# EAGLE schematic crown-C (EAGLE 6.4)
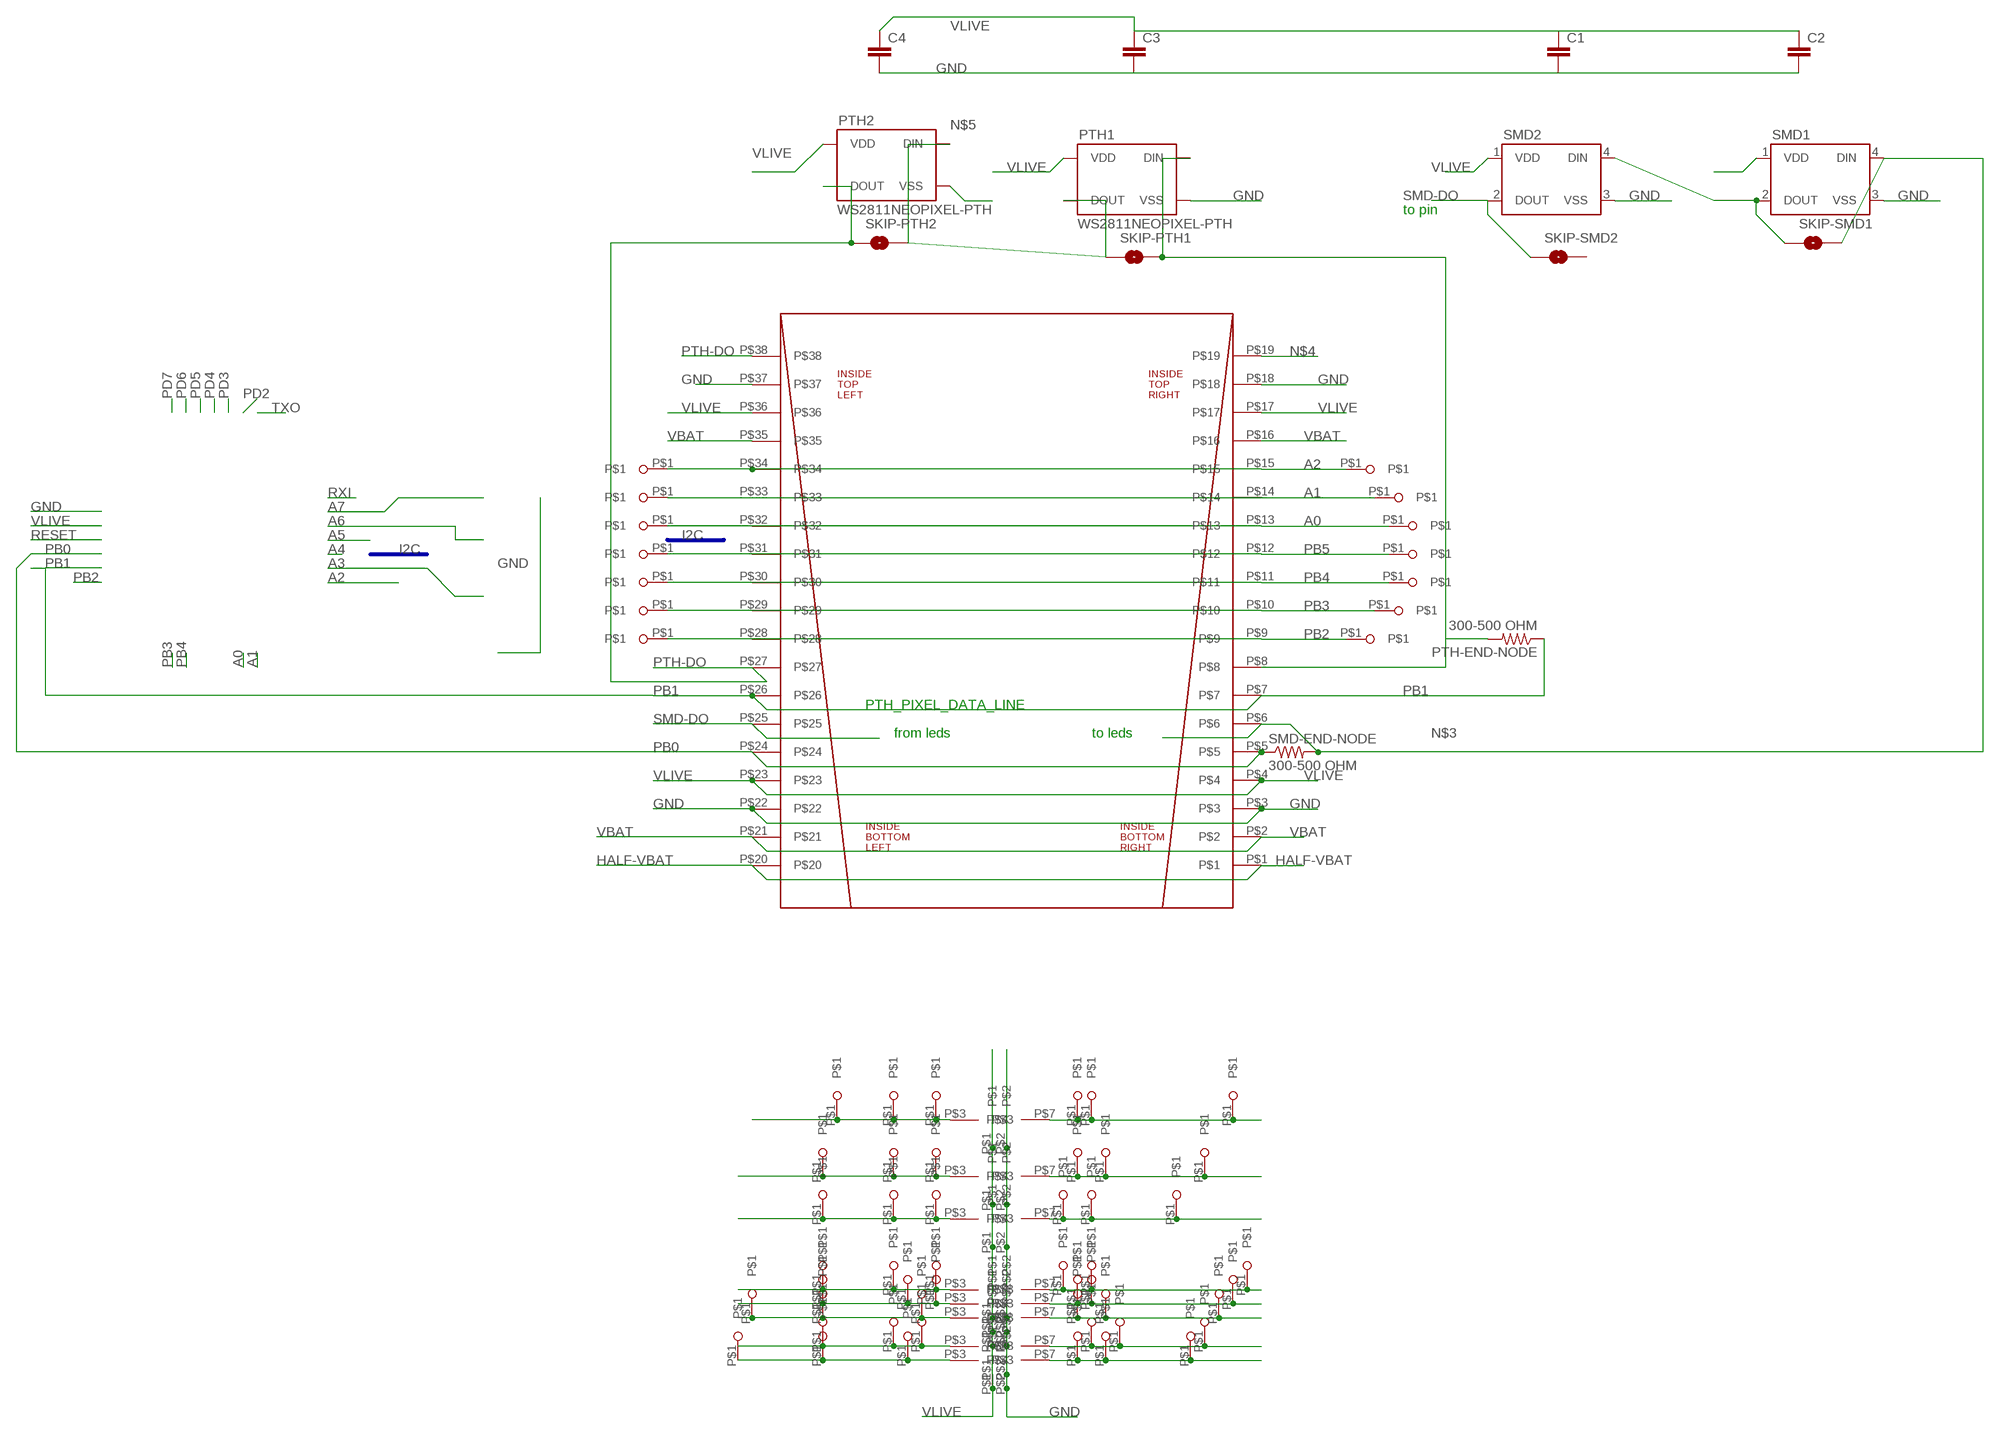
[diagram p0: schematic, sheet 1]

## Parts
C1  CAP0805  [0805]
C2  CAP0805  [0805]
C3  CAP0805  [0805]
C4  CAP0805  [0805]
PTH1  WS2811NEOPIXEL-PTH  [WS2811-PTH-FLAT]
PTH2  WS2811NEOPIXEL-PTH  [WS2811-PTH-FLAT]
PTH-END-NODE  300-500 OHM  RESISTOR0805-RES  [0805]
SKIP-PTH1  SOLDERJUMPERNC2  [SJ_2S-NOTRACE]
SKIP-PTH2  SOLDERJUMPERNC2  [SJ_2S-NOTRACE]
SKIP-SMD1  SOLDERJUMPERNC2  [SJ_2S-NOTRACE]
SKIP-SMD2  SOLDERJUMPERNC2  [SJ_2S-NOTRACE]
SMD1  WS2812B  [WS2812B]
SMD2  WS2812B  [WS2812B]
SMD-END-NODE  300-500 OHM  RESISTOR0805-RES  [0805]
U$1  SMD_BREADBOARD  [SMD_BREADBOARD_4X]
U$2  CROWNSTANDARD  [CROWN]
U$3  SMD_BREADBOARD  [SMD_BREADBOARD_4X]
U$4  SMD_BREADBOARD  [SMD_BREADBOARD_4X]
U$5  SMD_BREADBOARD  [SMD_BREADBOARD_4X]
U$6  SMD_BREADBOARD  [SMD_BREADBOARD_4X]
U$7  SMD_BREADBOARD  [SMD_BREADBOARD_4X]
U$8  SMD_BREADBOARD  [SMD_BREADBOARD_4X]
U$9  SMD_BREADBOARD  [SMD_BREADBOARD_4X]
U$10  SMD_PAD  [SMD_BREADBOARD_PAD]
U$11  SMD_PAD  [SMD_BREADBOARD_PAD]
U$12  SMD_PAD  [SMD_BREADBOARD_PAD]
U$13  SMD_PAD  [SMD_BREADBOARD_PAD]
U$14  SMD_PAD  [SMD_BREADBOARD_PAD]
U$15  SMD_PAD  [SMD_BREADBOARD_PAD]
U$16  SMD_PAD  [SMD_BREADBOARD_PAD]
U$17  SMD_PAD  [SMD_BREADBOARD_PAD]
U$18  SMD_PAD  [SMD_BREADBOARD_PAD]
U$19  SMD_PAD  [SMD_BREADBOARD_PAD]
U$20  SMD_PAD  [SMD_BREADBOARD_PAD]
U$21  SMD_PAD  [SMD_BREADBOARD_PAD]
U$22  SMD_PAD  [SMD_BREADBOARD_PAD]
U$23  SMD_PAD  [SMD_BREADBOARD_PAD]
U$24  SMD_PAD  [SMD_BREADBOARD_PAD]
U$25  SMD_PAD  [SMD_BREADBOARD_PAD]
U$26  SMD_PAD  [SMD_BREADBOARD_PAD]
U$27  SMD_PAD  [SMD_BREADBOARD_PAD]
U$28  SMD_PAD  [SMD_BREADBOARD_PAD]
U$29  SMD_PAD  [SMD_BREADBOARD_PAD]
U$30  SMD_PAD  [SMD_BREADBOARD_PAD]
U$31  SMD_PAD  [SMD_BREADBOARD_PAD]
U$32  SMD_PAD  [SMD_BREADBOARD_PAD]
U$33  SMD_PAD  [SMD_BREADBOARD_PAD]
U$34  SMD_PAD  [SMD_BREADBOARD_PAD]
U$35  SMD_PAD  [SMD_BREADBOARD_PAD]
U$36  SMD_PAD  [SMD_BREADBOARD_PAD]
U$37  SMD_PAD  [SMD_BREADBOARD_PAD]
U$38  SMD_PAD  [SMD_BREADBOARD_PAD]
U$39  SMD_PAD  [SMD_BREADBOARD_PAD]
U$40  SMD_PAD  [SMD_BREADBOARD_PAD]
U$41  SMD_PAD  [SMD_BREADBOARD_PAD]
U$42  SMD_PAD  [SMD_BREADBOARD_PAD]
U$43  SMD_PAD  [SMD_BREADBOARD_PAD]
U$44  SMD_PAD  [SMD_BREADBOARD_PAD]
U$45  SMD_PAD  [SMD_BREADBOARD_PAD]
U$46  SMD_PAD  [SMD_BREADBOARD_PAD]
U$47  SMD_PAD  [SMD_BREADBOARD_PAD]
U$48  SMD_PAD  [SMD_BREADBOARD_PAD]
U$49  SMD_PAD  [SMD_BREADBOARD_PAD]
U$50  SMD_PAD  [SMD_BREADBOARD_PAD]
U$51  SMD_PAD  [SMD_BREADBOARD_PAD]
U$52  SMD_PAD  [SMD_BREADBOARD_PAD]
U$53  SMD_PAD  [SMD_BREADBOARD_PAD]
U$54  SMD_PAD  [SMD_BREADBOARD_PAD]
U$55  SMD_PAD  [SMD_BREADBOARD_PAD]
U$56  SMD_PAD  [SMD_BREADBOARD_PAD]
U$57  SMD_PAD  [SMD_BREADBOARD_PAD]
U$58  SMD_PAD  [SMD_BREADBOARD_PAD]
U$59  SMD_PAD  [SMD_BREADBOARD_PAD]
U$60  SMD_PAD  [SMD_BREADBOARD_PAD]
U$61  SMD_PAD  [SMD_BREADBOARD_PAD]
U$62  SMD_PAD  [SMD_BREADBOARD_PAD]
U$63  SMD_PAD  [SMD_BREADBOARD_PAD]
U$64  SMD_PAD  [SMD_BREADBOARD_PAD]
U$65  SMD_PAD  [SMD_BREADBOARD_PAD]
U$66  SMD_PAD  [SMD_BREADBOARD_PAD]
U$67  SMD_PAD  [SMD_BREADBOARD_PAD]
U$68  SMD_PAD  [SMD_BREADBOARD_PAD]
U$69  SMD_PAD  [SMD_BREADBOARD_PAD]
U$70  SMD_PAD  [SMD_BREADBOARD_PAD]
U$71  SMD_PAD  [SMD_BREADBOARD_PAD]

## Nets
A0: U$2.P$13 U$2.P$32 U$44.P$1 U$55.P$1
A1: U$2.P$14 U$2.P$33 U$43.P$1 U$56.P$1
A2: U$2.P$15 U$2.P$34 U$42.P$1 U$58.P$1
GND: C1.2 C2.2 C3.2 C4.2 PTH1.P$2(VSS) PTH1.P$6(VSS) PTH2.P$2(VSS) PTH2.P$6(VSS) SMD1.3(VSS) SMD2.3(VSS) U$1.P$2 U$2.P$3 U$2.P$18 U$2.P$22 U$2.P$37 U$3.P$2 U$4.P$2 U$5.P$2 U$6.P$2 U$7.P$2 U$8.P$2 U$9.P$2
HALF-VBAT: U$2.P$1 U$2.P$20
N$2: U$1.P$3 U$24.P$1 U$25.P$1 U$63.P$1
N$3: SKIP-SMD1.2 SMD1.4(DIN) SMD-END-NODE.2 U$2.P$6
N$4: PTH1.P$4(DIN) PTH1.P$8(DIN) PTH-END-NODE.2 SKIP-PTH1.2 U$2.P$8 U$2.P$19
N$5: PTH1.P$1(DOUT) PTH1.P$5(DOUT) PTH2.P$4(DIN) PTH2.P$8(DIN) SKIP-PTH1.1 SKIP-PTH2.2
N$6: U$3.P$3 U$22.P$1 U$23.P$1 U$62.P$1
N$7: U$9.P$3 U$20.P$1 U$21.P$1 U$61.P$1
N$8: U$8.P$3 U$18.P$1 U$19.P$1 U$60.P$1
N$9: U$4.P$3 U$16.P$1 U$17.P$1 U$59.P$1
N$10: SKIP-SMD1.1 SMD1.2(DOUT) SMD2.4(DIN)
N$11: U$5.P$3 U$14.P$1 U$15.P$1 U$57.P$1
N$12: U$6.P$3 U$12.P$1 U$13.P$1 U$50.P$1
N$13: U$7.P$3 U$10.P$1 U$11.P$1 U$49.P$1
N$14: U$7.P$7 U$40.P$1 U$41.P$1 U$71.P$1
N$15: U$6.P$7 U$38.P$1 U$39.P$1 U$70.P$1
N$16: U$5.P$7 U$36.P$1 U$37.P$1 U$69.P$1
N$17: U$4.P$7 U$34.P$1 U$35.P$1 U$68.P$1
N$18: U$8.P$7 U$32.P$1 U$33.P$1 U$67.P$1
N$19: U$9.P$7 U$30.P$1 U$31.P$1 U$66.P$1
N$20: U$3.P$7 U$28.P$1 U$29.P$1 U$65.P$1
N$21: U$1.P$7 U$26.P$1 U$27.P$1 U$64.P$1
PB0: SMD-END-NODE.1 U$2.P$5 U$2.P$24
PB1: PTH-END-NODE.1 U$2.P$7 U$2.P$26
PB2: U$2.P$9 U$2.P$28 U$48.P$1 U$51.P$1
PB3: U$2.P$10 U$2.P$29 U$47.P$1 U$52.P$1
PB4: U$2.P$11 U$2.P$30 U$46.P$1 U$53.P$1
PB5: U$2.P$12 U$2.P$31 U$45.P$1 U$54.P$1
PTH-DO: PTH2.P$1(DOUT) PTH2.P$5(DOUT) SKIP-PTH2.1 U$2.P$27 U$2.P$38
SMD-DO: SKIP-SMD2.1 SMD2.2(DOUT) U$2.P$25
VBAT: U$2.P$2 U$2.P$16 U$2.P$21 U$2.P$35
VLIVE: C1.1 C2.1 C3.1 C4.1 PTH1.P$3(VDD) PTH1.P$7(VDD) PTH2.P$3(VDD) PTH2.P$7(VDD) SMD1.1(VDD) SMD2.1(VDD) U$1.P$1 U$2.P$4 U$2.P$17 U$2.P$23 U$2.P$36 U$3.P$1 U$4.P$1 U$5.P$1 U$6.P$1 U$7.P$1 U$8.P$1 U$9.P$1
Unconnected: SKIP-SMD2.2

## Buses
I2C

## Notes on the sheet
- to pin
- PTH_PIXEL_DATA_LINE
- from leds | to leds

## Library data of the parts
C1-C4 = SparkFun-Passives:CAP: Capacitor Standard 0603 ceramic capacitor, and 0.1" leaded capacitor.
PTH1 PTH2 = tekdemo:WS2811
PTH-END-NODE SMD-END-NODE = SparkFun-Passives:RESISTOR: Resistor Basic schematic elements and footprints for 0603, 1206, and PTH resistors.
SKIP-PTH1 SKIP-PTH2 SKIP-SMD1 SKIP-SMD2 = SparkFun-Passives:SOLDERJUMPER: Solder Jumper Standard SMD solder jumper. Used to automate production. Two varients : Normally Open and Normally Closed are the same, but have different paste layers. NC will have a large amount of paste and should jumper during reflow.
SMD1 SMD2 = SparkFun-LED:WS2812B: WS2812B - Intelligent control LED integrated light source Technical Specifications: Power Supply Voltage (VDD): 3.5 to 5.3 V Input Voltage (VI): -0.5 to VDD+0.5 V Operating Junction Temperature (Topt): -25°C to +80°C Storage Temperature Range (Tstg): -55°C to +150°C
U$1 U$3-U$9 = pcb_crown:SMD_BREADBOARD
U$2 = pcb_crown:CROWN
U$10-U$71 = pcb_crown:SMD_PAD